# Altium project LVDS Converter.PrjPcb
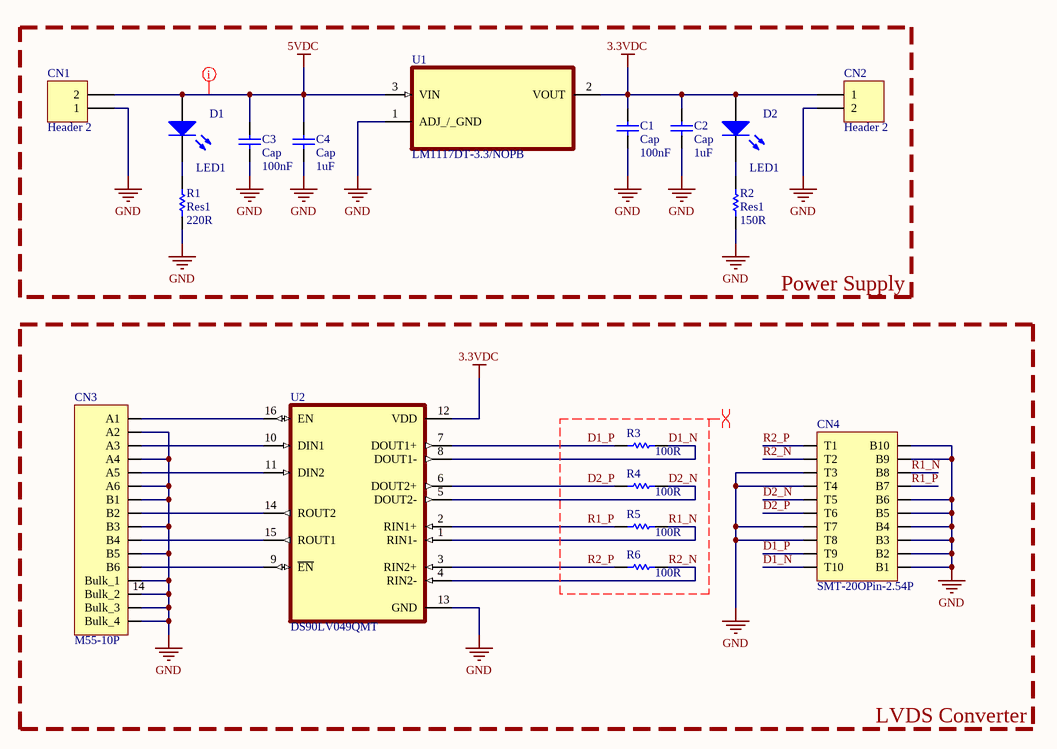
[diagram p0: SCHEMATIC_MAIN.SchDoc]
1 sheet, 18 parts. Net scope: global (net labels, ports and power ports of the same name join across sheets).
Board files: PCB.PcbDoc, Panelize.PcbDoc

## Sheet SCHEMATIC_MAIN.SchDoc
size A; SheetNumber: 1; SheetTotal: 1

### Parts
C1  Cap  value 100nF  [6-0805_M]
C2  Cap  value 1uF  [6-0805_M]
C3  Cap  value 100nF  [6-0805_M]
C4  Cap  value 1uF  [6-0805_M]
CN1  Header 2  [HDR1X2]
CN2  Header 2  [HDR1X2]
CN3  M55-10P  [2TH-14SMT]
CN4  SMT-20OPin-2.54P  [SMT-20OPin-2.54P]
D1  LED1  [6-0805_M]
D2  LED1  [6-0805_M]
R1  Res1  value 220R  [6-0805_M]
R2  Res1  value 150R  [6-0805_M]
R3  value 100R  [6-0805_M]  (hidden comment: Res1)
R4  value 100R  [6-0805_M]  (hidden comment: Res1)
R5  value 100R  [6-0805_M]  (hidden comment: Res1)
R6  value 100R  [6-0805_M]  (hidden comment: Res1)
U1  LM1117DT-3.3/NOPB  [TO228P970X238-3N]
U2  DS90LV049QMT  [SOP65P640X120-16N]

### Blocks framed on the sheet
Power Supply: C1-C4 CN1 CN2 D1 D2 R1 R2 U1
LVDS Converter: CN3 CN4 R3-R6 U2

### Nets
3.3VDC: C1.2 C2.2 CN2.1 D2.1(A) U1.2(VOUT) U2.12(VDD)
5VDC: C3.2 C4.2 CN1.2 D1.1(A) U1.3(VIN)
GND: C1.1 C2.1 C3.1 C4.1 CN1.1 CN2.2 CN3.2(A2) CN3.4(A4) CN3.6(A6) CN3.7(B1) CN3.9(B3) CN3.11(B5) CN3.13(Bulk_1) CN3.14(Bulk_2) CN3.15(Bulk_3) CN3.16(Bulk_4) CN4.3(T3) CN4.4(T4) CN4.7(T7) CN4.8(T8) CN4.11(B1) CN4.12(B2) CN4.13(B3) CN4.14(B4) CN4.15(B5) CN4.16(B6) CN4.19(B9) CN4.20(B10) R1.1 R2.1 U1.1(ADJ_/_GND) U2.13(GND)
D1_N: CN4.10(T10) R3.1 U2.8(DOUT1-)
D1_P: CN4.9(T9) R3.2 U2.7(DOUT1+)
D2_N: CN4.5(T5) R4.1 U2.5(DOUT2-)
D2_P: CN4.6(T6) R4.2 U2.6(DOUT2+)
R1_N: CN4.18(B8) R5.1 U2.1(RIN1-)
R1_P: CN4.17(B7) R5.2 U2.2(RIN1+)
R2_N: CN4.2(T2) R6.1 U2.4(RIN2-)
R2_P: CN4.1(T1) R6.2 U2.3(RIN2+)
NetCN3_1: CN3.1(A1) U2.16(EN)
NetCN3_3: CN3.3(B2) U2.14(ROUT2)
NetCN3_5: CN3.5(A3) U2.10(DIN1)
NetCN3_8: CN3.8(B4) U2.15(ROUT1)
NetCN3_10: CN3.10(A5) U2.11(DIN2)
NetCN3_12: CN3.12(B6) U2.9(~{EN})
NetD1_2: D1.2(K) R1.2
NetD2_2: D2.2(K) R2.2

### Layout directives
rule Width Constraint [Pref Width = 1mm    Min Width = 1mm    Max Width = 1mm]: 5VDC
differential pair: D1_N, D1_P, D2_N, D2_P, R1_N, R1_P, R2_N, R2_P

### Library data of the parts
C1-C4 = Cap: Capacitor; Published: 8-Jun-2000; LatestRevisionDate: 17-Jul-2002; LatestRevisionNote: Re-released for DXP Platform.; PackageReference: RAD-0.3; Publisher: Altium Limited; PackageDescription: Radial Cap, Thru-Hole; 2 Leads; 0.3 in Pin Spacing
CN1 CN2 = Header 2: Header, 2-Pin; LatestRevisionDate: 17-Jul-2002; LatestRevisionNote: Re-released for DXP Platform.; Publisher: Altium Limited
CN3 = M55-7101286646: 10 Position SMD Connector
D1 D2 = LED1: Typical RED GaAs LED; Published: 8-Jun-2000; LatestRevisionDate: 08-Jul-2005; LatestRevisionNote: Mech Layer 1 removed.; PackageReference: LED-1; Publisher: Altium Limited; PackageDescription: LED; 2 Leads
R1-R6 = Res1: Resistor; Published: 8-Jun-2000; LatestRevisionDate: 17-Jul-2002; LatestRevisionNote: Re-released for DXP Platform.; PackageReference: AXIAL-0.3; Publisher: Altium Limited; PackageDescription: Axial Device, Thru-Hole; 2 Leads; 0.3 in Pin Spacing
U1 = LM1117DT-3.3/NOPB: Linear Voltage Regulator IC 1 Output 800mA TO-252-3; MP: LM1117DT33; MF: Texas Instruments; SnapEDA_Link: https://www.snapeda.com/parts/LM1117DT33/Texas%20Instruments/view-part/19360/?ref=snap; Value: *; Package: None; Price: None; Availability: Unavailable
U2 = DS90LV049QMT: Automotive LVDS Dual High-Speed Differential Transceiver 16-TSSOP -40 to 125; MF: Texas Instruments; MP: DS90LV049QMT/NOPB; Price: None; Value: *; Package: TSSOP-16 Texas Instruments; Mouser-Purchase-URL: https://snapeda.com/shop?store=Mouser&id=15994; SnapEDA_Link: https://www.snapeda.com/parts/DS90LV049QMT/NOPB/Texas%20Instruments/view-part/15994/?ref=snap; Texas_Instruments-Purchase-URL: https://snapeda.com/shop?store=Texas+Instruments&id=15994; Availability: Warning; DigiKey-Purchase-URL: https://snapeda.com/shop?store=DigiKey&id=15994